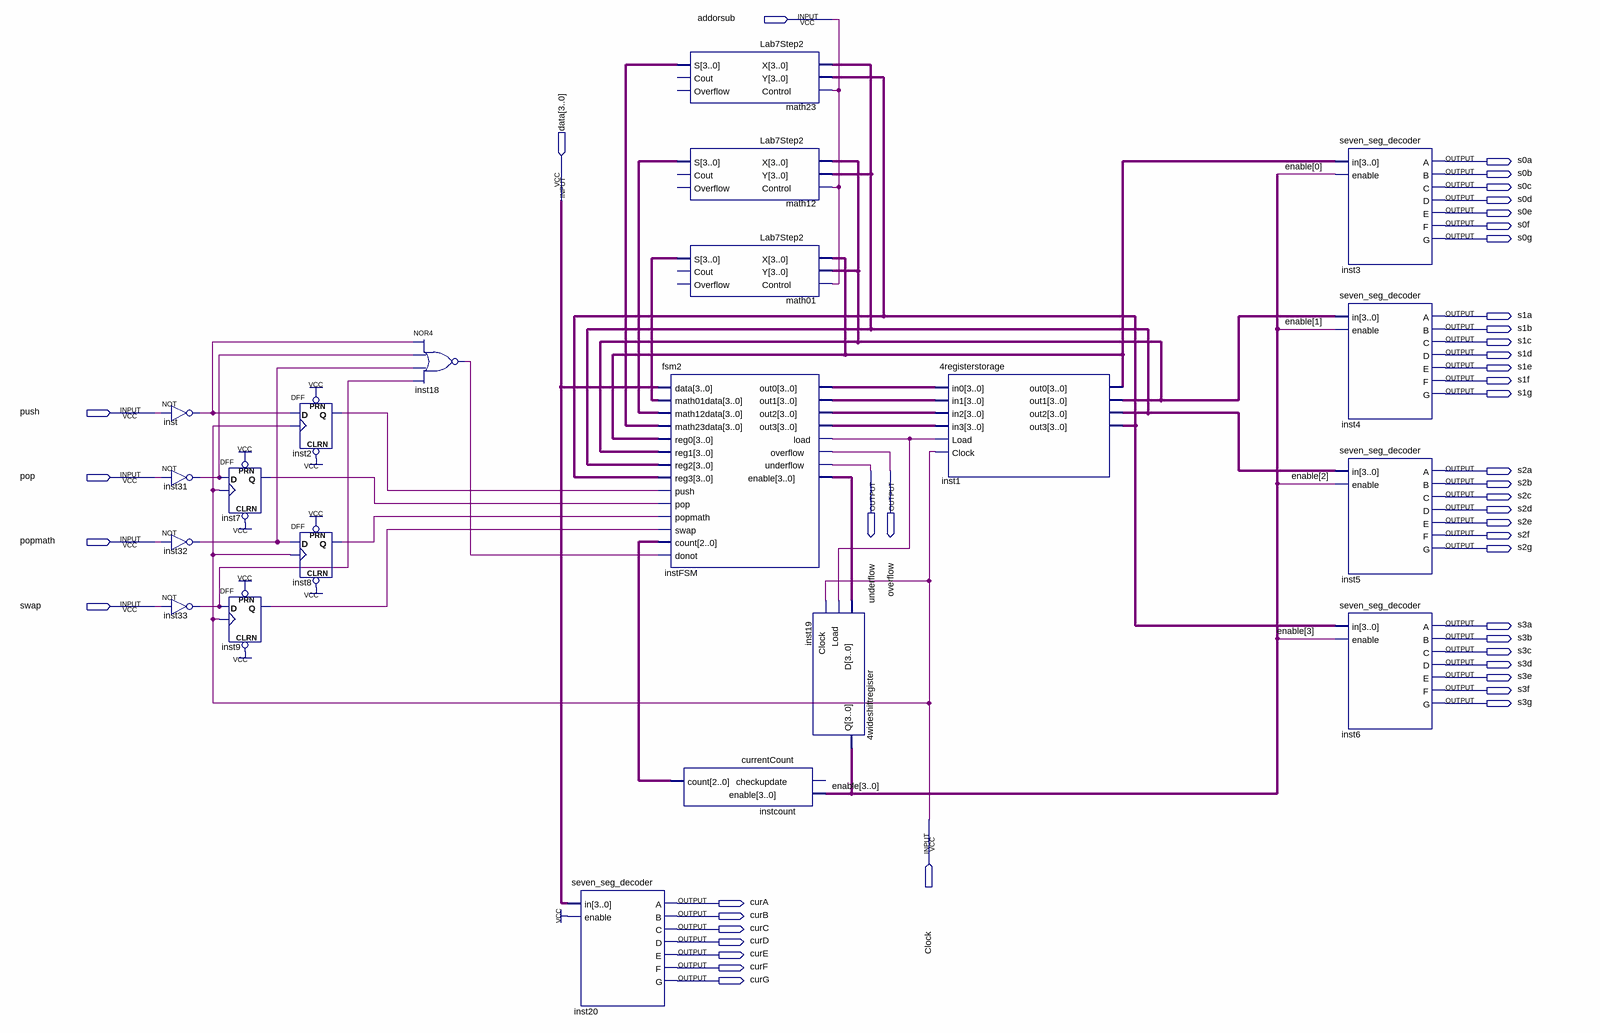
[diagram p0: schematic sheet]
// Quartus schematic EthanWieczorekFinal.bdf as structural Verilog: 21 symbols, 44 pins
module EthanWieczorekFinal (
  input  addorsub,
  input  [3:0] data,
  input  push,
  input  pop,
  input  popmath,
  input  swap,
  input  Clock,
  output s0a,
  output s0b,
  output s0c,
  output s0d,
  output s0e,
  output s0f,
  output s0g,
  output s1a,
  output s1b,
  output s1c,
  output s1d,
  output s1e,
  output s1f,
  output s1g,
  output underflow,
  output overflow,
  output s2a,
  output s2b,
  output s2c,
  output s2d,
  output s2e,
  output s2f,
  output s2g,
  output s3a,
  output s3b,
  output s3c,
  output s3d,
  output s3e,
  output s3f,
  output s3g,
  output curA,
  output curB,
  output curC,
  output curD,
  output curE,
  output curF,
  output curG
);

  wire inst2_q, inst7_q, inst8_q, inst9_q, inst18_out, inst31_out, inst32_out, inst33_out, inst_out,
       instFSM_load;
  wire [2:0] instcount_count;
  wire [3:0] enable, inst1_out0, inst1_out1, inst1_out2, inst1_out3, instFSM_enable, instFSM_out0,
       instFSM_out1, instFSM_out2, instFSM_out3, math01_s, math12_s, math23_s;

  not inst (inst_out, push);
  not inst31 (inst31_out, pop);
  not inst32 (inst32_out, popmath);
  not inst33 (inst33_out, swap);
  DFF inst7 (.CLRN(1'b1), .CLK(Clock), .D(inst31_out), .PRN(1'b1), .Q(inst7_q));
  DFF inst9 (.CLRN(1'b1), .CLK(Clock), .D(inst33_out), .PRN(1'b1), .Q(inst9_q));
  DFF inst2 (.CLRN(1'b1), .CLK(Clock), .D(inst_out), .PRN(1'b1), .Q(inst2_q));
  DFF inst8 (.CLRN(1'b1), .CLK(Clock), .D(inst32_out), .PRN(1'b1), .Q(inst8_q));
  nor inst18 (inst18_out, inst_out, inst31_out, inst32_out, inst33_out);
  seven_seg_decoder inst20 (
    .in(data), .enable(1'b1), .A(curA), .B(curB), .C(curC), .D(curD), .E(curE), .F(curF), .G(curG));
  fsm2 instFSM (
    .data(data), .math01data(math01_s), .math12data(math12_s), .math23data(math23_s), .reg0(inst1_out0),
    .reg1(inst1_out1), .reg2(inst1_out2), .reg3(inst1_out3), .push(inst2_q), .pop(inst7_q),
    .popmath(inst8_q), .swap(inst9_q), .count(instcount_count), .donot(inst18_out), .out0(instFSM_out0),
    .out1(instFSM_out1), .out2(instFSM_out2), .out3(instFSM_out3), .load(instFSM_load), .overflow(overflow),
    .underflow(underflow), .enable(instFSM_enable));
  currentCount instcount (.enable(enable), .count(instcount_count));  // open: checkupdate
  Lab7Step2 math23 (.X(inst1_out2), .Y(inst1_out3), .Control(addorsub), .S(math23_s));  // open: Cout, Overflow
  Lab7Step2 math12 (.X(inst1_out1), .Y(inst1_out2), .Control(addorsub), .S(math12_s));  // open: Cout, Overflow
  Lab7Step2 math01 (.X(inst1_out0), .Y(inst1_out1), .Control(addorsub), .S(math01_s));  // open: Cout, Overflow
  \4wideshiftregister  inst19 (.D(instFSM_enable), .Load(instFSM_load), .Clock(Clock), .Q(enable));
  \4registerstorage  inst1 (
    .in0(instFSM_out0), .in1(instFSM_out1), .in2(instFSM_out2), .in3(instFSM_out3), .Load(instFSM_load),
    .Clock(Clock), .out0(inst1_out0), .out1(inst1_out1), .out2(inst1_out2), .out3(inst1_out3));
  seven_seg_decoder inst3 (
    .in(inst1_out0), .enable(enable[0]), .A(s0a), .B(s0b), .C(s0c), .D(s0d), .E(s0e), .F(s0f), .G(s0g));
  seven_seg_decoder inst4 (
    .in(inst1_out1), .enable(enable[1]), .A(s1a), .B(s1b), .C(s1c), .D(s1d), .E(s1e), .F(s1f), .G(s1g));
  seven_seg_decoder inst5 (
    .in(inst1_out2), .enable(enable[2]), .A(s2a), .B(s2b), .C(s2c), .D(s2d), .E(s2e), .F(s2f), .G(s2g));
  seven_seg_decoder inst6 (
    .in(inst1_out3), .enable(enable[3]), .A(s3a), .B(s3b), .C(s3c), .D(s3d), .E(s3e), .F(s3f), .G(s3g));
endmodule
